# EAGLE board USB_Amp (EAGLE 9.6.2)
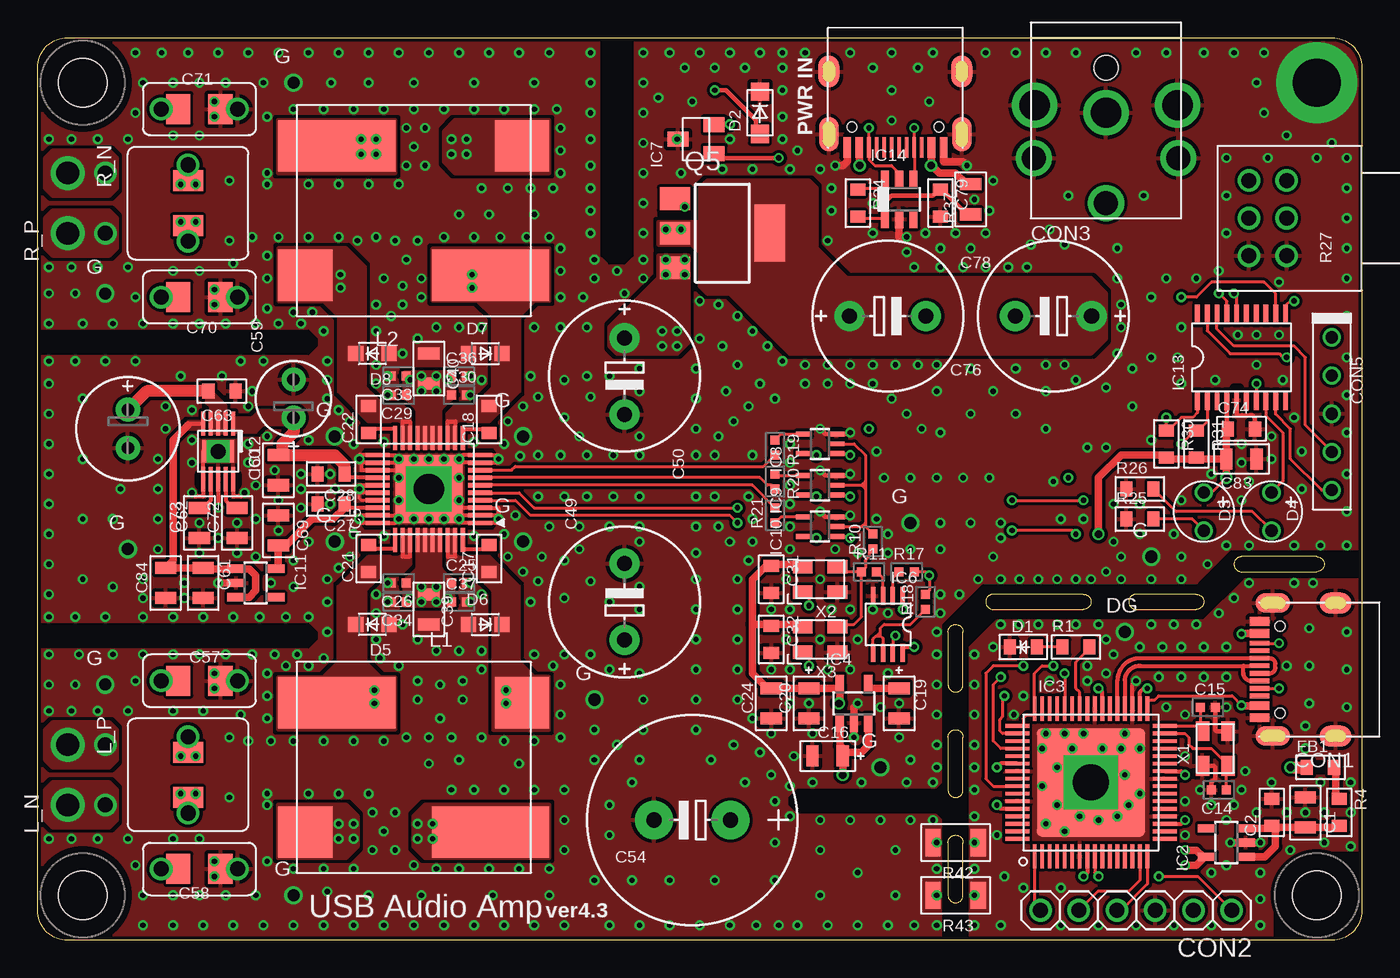
[diagram p2: board, top side]
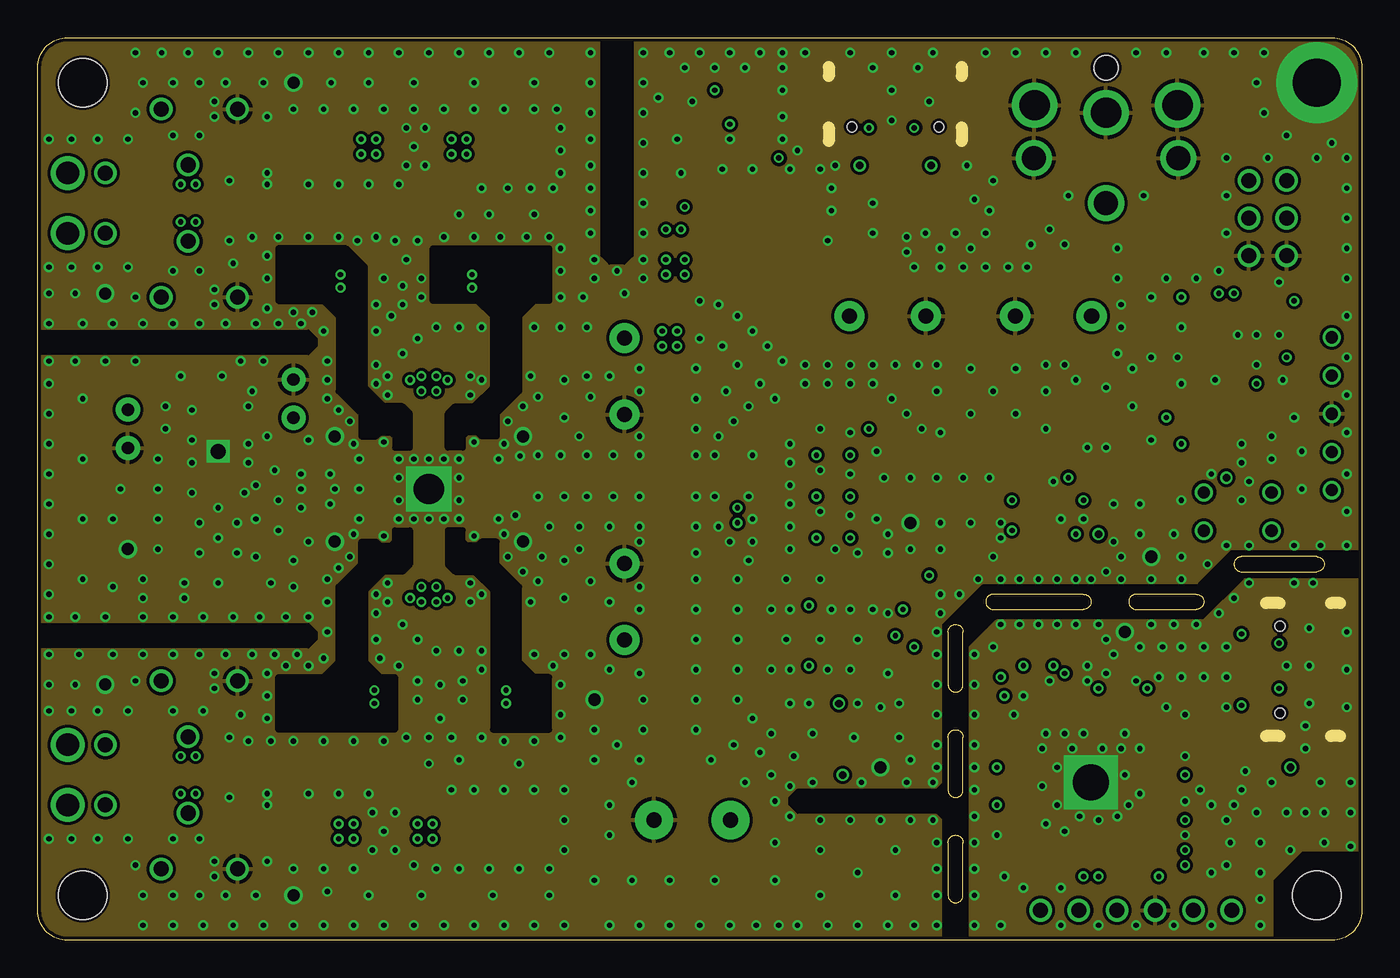
[diagram p3: board, inner layer Route2]
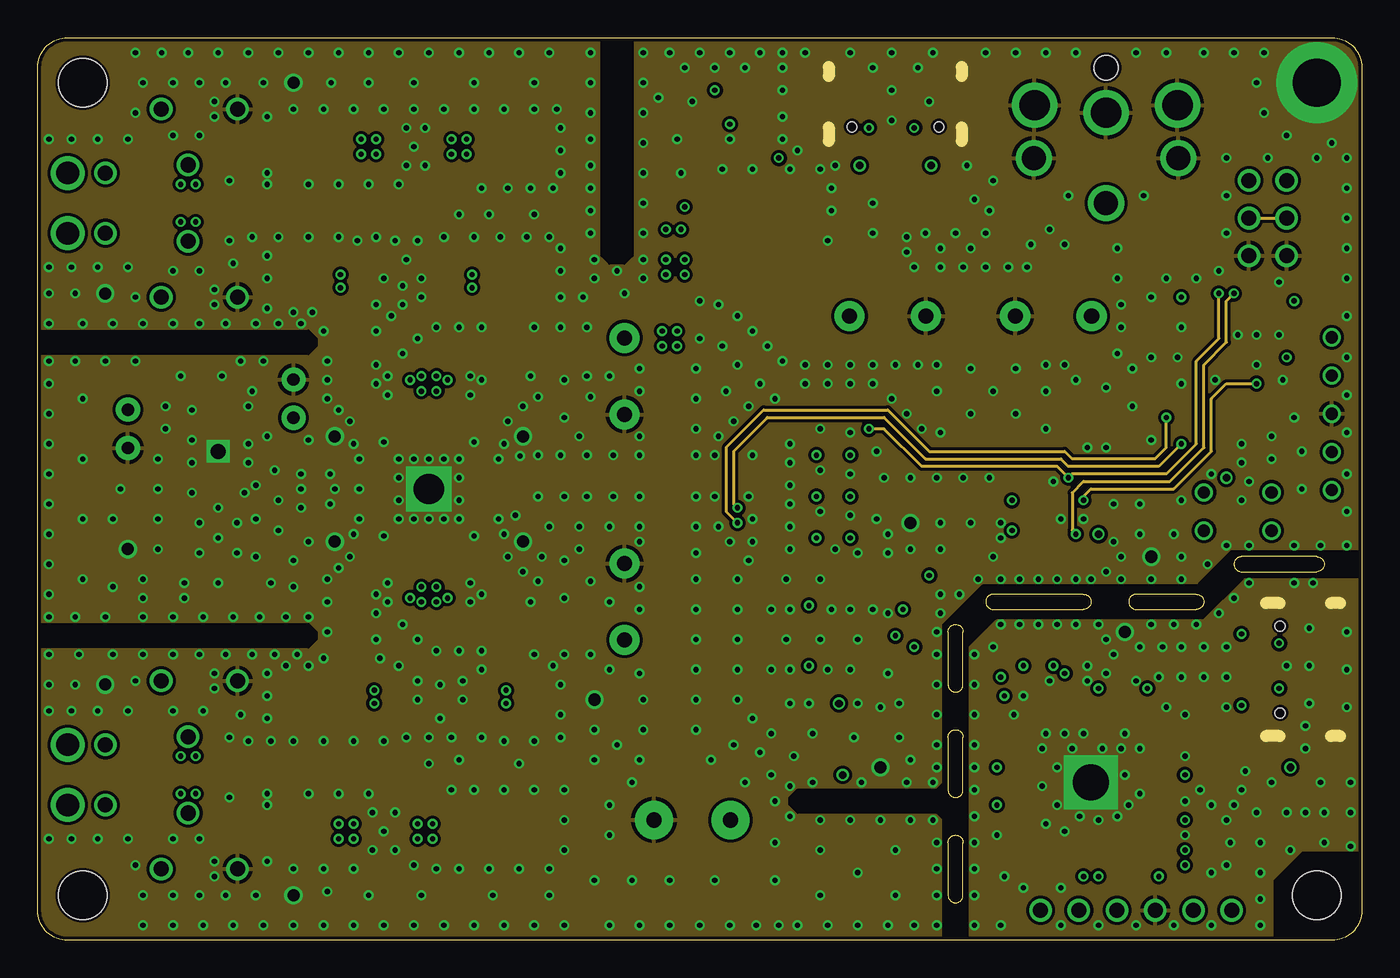
[diagram p4: board, inner layer Route15]
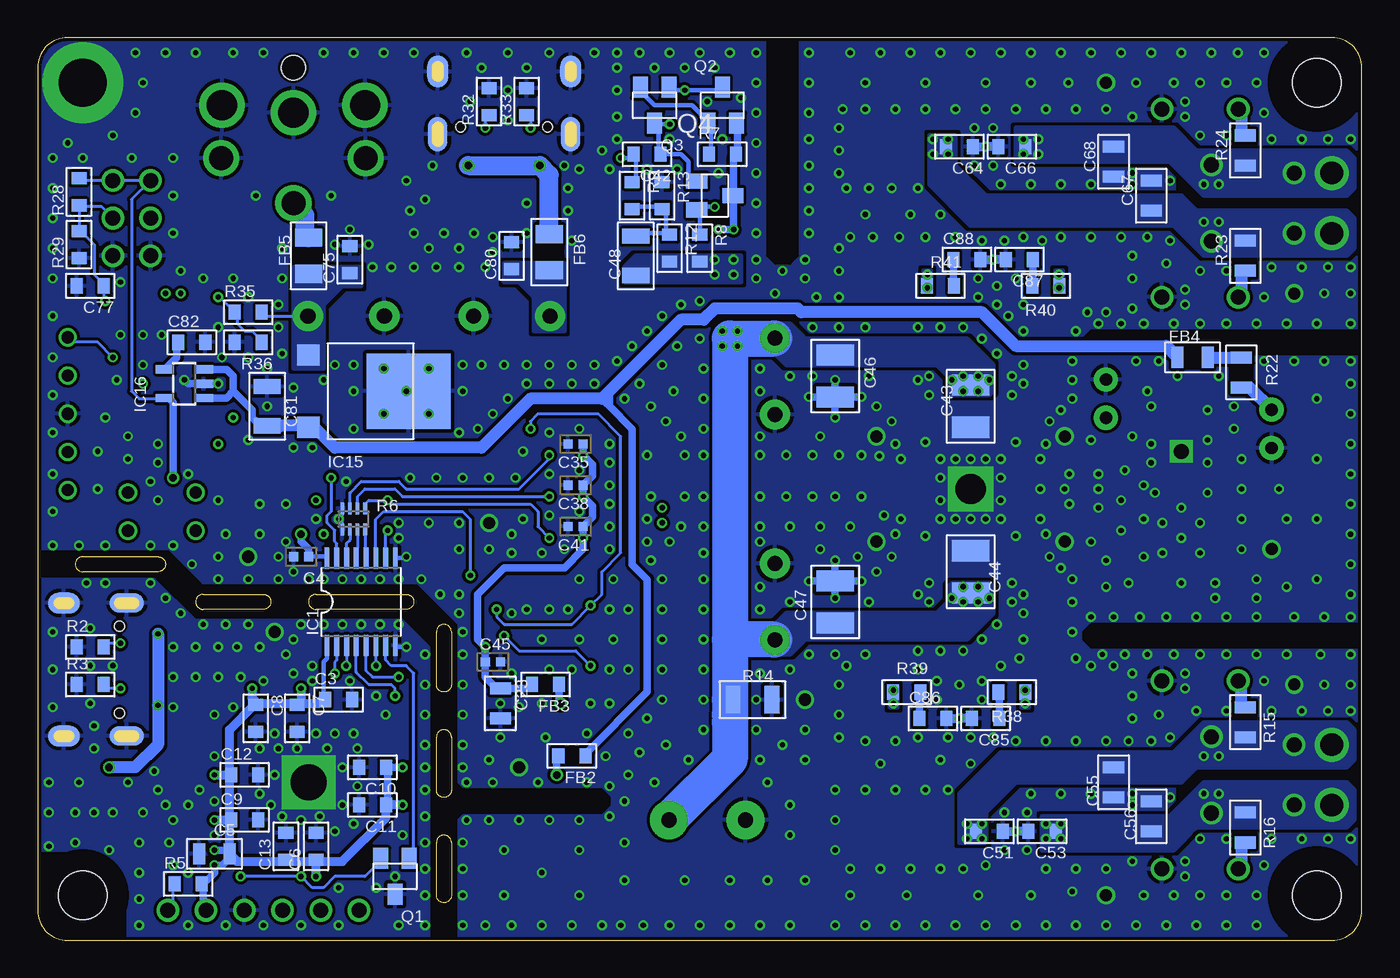
[diagram p5: board, bottom side, seen from below]

Size 88 x 60 mm. Coordinates in mm from the lower left corner, seen from the top.
Outline: 0,2 0,58 arc-90 2,60 86,60 arc-90 88,58 88,2 arc-90 86,0 2,0 arc-90 0,2
Outline: 69.5,23 arc-180 69.5,22 63.5,22 arc-180 63.5,23 69.5,23
Outline: 85,25.5 arc-180 85,24.5 80,24.5 arc-180 80,25.5 85,25.5
Outline: 77,23 arc-180 77,22 73,22 arc-180 73,23 77,23
Outline: 60.5,20.5 arc-180 61.5,20.5 61.5,17 arc-180 60.5,17 60.5,20.5
Outline: 60.5,6.5 arc-180 61.5,6.5 61.5,3 arc-180 60.5,3 60.5,6.5
Outline: 60.5,13.5 arc-180 61.5,13.5 61.5,10 arc-180 60.5,10 60.5,13.5
Copper layers (1*2*15*16): Top 0.035mm / dielectric 0.2mm / Route2 0.0175mm / dielectric 1.065mm / Route15 0.0175mm / dielectric 0.2mm / Bottom 0.035mm
Design rules "JLCPCB_4layer_2oz *": minimum track width 8mil, minimum drill 0.3mm, track to track 8mil, track to pad 8mil, pad to pad 8mil, via to via 8mil, smd to smd 0mil, copper to edge 0.2mm, drill to drill 0.4mm, minimum pad ring 8mil, minimum via ring 6mil, stop-mask expansion 2mil, vias tented up to drill 1mm, thermal gap 10mil
Net classes: 1 USB: width 0.27 mm
tRestrict: 3 lines
bRestrict: 8 lines

## Footprints (pad centres in the part's own frame; a part is rotated, then mirrored left to right if it is on the bottom)
2012 = smd 0.8 x 1.4: 1 -1,0; 2 1,0
1608C = smd 0.8 x 1: 1 -0.9,0; 2 0.9,0
1005 = smd 0.6 x 0.6: 1 -0.5,0; 2 0.5,0
2012-POL = smd 0.8 x 1.4: 1 -1,0; 2 1,0
3225 = smd 1.4 x 2.5: 1 -1.4,0; 2 1.4,0
3216 = smd 1 x 1.8: 1 -1.3,0; 2 1.3,0
E5-10 = drill 1 pad 2: + -2.54,0; - 2.54,0
C050W = drill 1: 1 -2.54,0; 2 2.54,0 | smd 1.4 x 2: 3 -1.5,0; 4 1.5,0
E5-13 = drill 1.016 pad 2.54: + -2.54,0; - 2.54,0
C050W2 = drill 1: 1 -2.54,0; 2 2.54,0 | smd 1.6 x 2: 3 -1.4,0; 4 1.4,0
E2.5-5 = drill 0.813 pad 1.6: + -1.27,0; - 1.27,0
E2.5-6.5 = drill 0.813 pad 1.6: + -1.27,0; - 1.27,0
5077CR-16-SMC2-BK-TR-2OZ = smd 0.58 x 1.34: A1,B12:GND -3.2,0.3; A4,B9:VBUS -2.4,0.3; B1,A12:GND 3.2,0.3; B4,A9:VBUS 2.4,0.3 | smd 0.28 x 1.34: A5:CC1 -1.25,0.3; A6:DP1 -0.25,0.3; A7:DN1 0.25,0.3; A8:SBU1 1.25,0.3; B5:CC2 1.75,0.3; B6:DP2 0.75,0.3; B7:DN2 -0.75,0.3; B8:SBU2 -1.75,0.3 | smd 1.3 x 2.3: SHILED1 -4.42,-0.57; SHILED2 4.42,-0.57 | smd 1.4 x 2.1: SHILED3 -4.42,-4.75; SHILED4 4.42,-4.75 | smd 1.3 x 2.3 bottom: SHILED5 -4.42,-0.57; SHILED7 4.42,-0.57 | smd 1.4 x 2.1 bottom: SHILED6 -4.42,-4.75; SHILED8 4.42,-4.75 | hole 0.65: -2.89,-1.07; 2.89,-1.07
1X06 = drill 1: 1 -6.35,0; 2 -3.81,0; 3 -1.27,0; 4 1.27,0; 5 3.81,0; 6 6.35,0
2.1MM_CON = drill 1.6: 1 0,-6; 5 -4.8,-3; 6 4.8,-3 | drill 2: 2 0,0; 3 -4.75,0.5; 4 4.75,0.5 | hole 1.6: 0,3
SWD_CON = drill 0.8: 1 -5.08,0; 2 -2.54,0; 3 0,0; 4 2.54,0; 5 5.08,0
D1608 = smd 0.8 x 1: A 0.9,0; K -0.9,0
SOD123 = smd 1.2 x 1.2: 1 -1.4,0; 2 1.4,0
LED2.5 = drill 0.813: A -1.27,0; K 1.27,0
SOD323 = smd 1 x 1: 1 -1.1,0; 2 1.1,0
HOLE_3.2 = hole 3.2: 0,0
HOLE_3.2_CON2 = drill 3.2 pad 5.4: T 0,0
1608-FB = smd 0.8 x 1: 1 -0.9,0; 2 0.9,0
2012-R = smd 0.8 x 1.4: 1 -1,0; 2 1,0
3216-FB = smd 1.2 x 1.8: 1 -1.2,0; 2 1.2,0
TSSOP16 = smd 0.32 x 1.4: 1 -2.275,-2.9; 2 -1.625,-2.9; 3 -0.975,-2.9; 4 -0.325,-2.9; 5 0.325,-2.9; 6 0.975,-2.9; 7 1.625,-2.9; 8 2.275,-2.9; 9 2.275,2.9; 10 1.625,2.9; 11 0.975,2.9; 12 0.325,2.9; 13 -0.325,2.9; 14 -0.975,2.9; 15 -1.625,2.9; 16 -2.275,2.9
SOT23-5 = smd 0.55 x 1.2: 1 -0.95,-1.3; 2 0,-1.3; 3 0.95,-1.3; 4 0.95,1.3; 5 -0.95,1.3
QFN64HT = smd 0.25 x 1.6: 1 -3.75,-4.9; 2 -3.25,-4.9; 3 -2.75,-4.9; 4 -2.25,-4.9; 5 -1.75,-4.9; 6 -1.25,-4.9; 7 -0.75,-4.9; 8 -0.25,-4.9; 9 0.25,-4.9; 10 0.75,-4.9; 11 1.25,-4.9; 12 1.75,-4.9; 13 2.25,-4.9; 14 2.75,-4.9; 15 3.25,-4.9; 16 3.75,-4.9; 33 3.75,4.9; 34 3.25,4.9; 35 2.75,4.9; 36 2.25,4.9; 37 1.75,4.9; 38 1.25,4.9; 39 0.75,4.9; 40 0.25,4.9; 41 -0.25,4.9; 42 -0.75,4.9; 43 -1.25,4.9; 44 -1.75,4.9; 45 -2.25,4.9; 46 -2.75,4.9; 47 -3.25,4.9; 48 -3.75,4.9 | smd 1.6 x 0.25: 17 4.9,-3.75; 18 4.9,-3.25; 19 4.9,-2.75; 20 4.9,-2.25; 21 4.9,-1.75; 22 4.9,-1.25; 23 4.9,-0.75; 24 4.9,-0.25; 25 4.9,0.25; 26 4.9,0.75; 27 4.9,1.25; 28 4.9,1.75; 29 4.9,2.25; 30 4.9,2.75; 31 4.9,3.25; 32 4.9,3.75; 49 -4.9,3.75; 50 -4.9,3.25; 51 -4.9,2.75; 52 -4.9,2.25; 53 -4.9,1.75; 54 -4.9,1.25; 55 -4.9,0.75; 56 -4.9,0.25; 57 -4.9,-0.25; 58 -4.9,-0.75; 59 -4.9,-1.25; 60 -4.9,-1.75; 61 -4.9,-2.25; 62 -4.9,-2.75; 63 -4.9,-3.25; 64 -4.9,-3.75 | drill 2.4 pad 3.6 square: HT 0,0 | smd 7.2 x 7.2: HT2 0,0
QFN40HT = smd 0.28 x 1.6: 1 -2.25,-3.4; 2 -1.75,-3.4; 3 -1.25,-3.4; 4 -0.75,-3.4; 5 -0.25,-3.4; 6 0.25,-3.4; 7 0.75,-3.4; 8 1.25,-3.4; 9 1.75,-3.4; 10 2.25,-3.4; 21 2.25,3.4; 22 1.75,3.4; 23 1.25,3.4; 24 0.75,3.4; 25 0.25,3.4; 26 -0.25,3.4; 27 -0.75,3.4; 28 -1.25,3.4; 29 -1.75,3.4; 30 -2.25,3.4 | smd 1.6 x 0.28: 11 3.4,-2.25; 12 3.4,-1.75; 13 3.4,-1.25; 14 3.4,-0.75; 15 3.4,-0.25; 16 3.4,0.25; 17 3.4,0.75; 18 3.4,1.25; 19 3.4,1.75; 20 3.4,2.25; 31 -3.4,2.25; 32 -3.4,1.75; 33 -3.4,1.25; 34 -3.4,0.75; 35 -3.4,0.25; 36 -3.4,-0.25; 37 -3.4,-0.75; 38 -3.4,-1.25; 39 -3.4,-1.75; 40 -3.4,-2.25 | drill 2 pad 3 square: HT 0,0 | smd 4.5 x 4.5: HT2 0,0
SSOP8-P-0.65 = smd 0.3 x 1.2: 1 -0.975,-1.9; 2 -0.325,-1.9; 3 0.325,-1.9; 4 0.975,-1.9; 5 0.975,1.9; 6 0.325,1.9; 7 -0.325,1.9; 8 -0.975,1.9
SC59 = smd 1 x 1.4: 1 -0.95,-1.2; 2 0.95,-1.2; 3 0,1.2
TSSOP5 = smd 0.32 x 1: 1 -0.65,-1.1; 2 0,-1.1; 3 0.65,-1.1; 4 0.65,1.1; 5 -0.65,1.1
PLP10 = smd 0.26 x 1.6: 1 -1,-1.85; 2 -0.5,-1.85; 3 0,-1.85; 4 0.5,-1.85; 5 1,-1.85; 6 1,1.85; 7 0.5,1.85; 8 0,1.85; 9 -0.5,1.85; 10 -1,1.85 | drill 1 pad 1.5 square: HT 0,0 | smd 2.1 x 1.5: HT2 0,0
TSSOP20 = smd 0.32 x 1.3: 1 -2.925,-2.85; 2 -2.275,-2.85; 3 -1.625,-2.85; 4 -0.975,-2.85; 5 -0.325,-2.85; 6 0.325,-2.85; 7 0.975,-2.85; 8 1.625,-2.85; 9 2.275,-2.85; 10 2.925,-2.85; 11 2.925,2.85; 12 2.275,2.85; 13 1.625,2.85; 14 0.975,2.85; 15 0.325,2.85; 16 -0.325,2.85; 17 -0.975,2.85; 18 -1.625,2.85; 19 -2.275,2.85; 20 -2.925,2.85
SOT23-6 = smd 0.55 x 1.2: 1 -0.95,-1.3; 2 0,-1.3; 3 0.95,-1.3; 4 0.95,1.3; 5 0,1.3; 6 -0.95,1.3
DPAK = smd 1.4 x 1.5: 1 -2.4,0; 3 2.4,0 | smd 5 x 5.6: 2 0,6.65
UA8014 = smd 7.8 x 3.4: 1 -5.1,4.3; 3 5.1,-4.3 | smd 3.6 x 3.4: 2 -7.2,-4.3; 4 7.2,4.3
SOT223 = smd 1.5 x 2: 1 -2.3,-3.15; 2 0,-3.15; 3 2.3,-3.15 | smd 3.8 x 2: 4 0,3.15
1608 = smd 0.8 x 1: 1 -0.9,0; 2 0.9,0
EXB28V = smd 0.26 x 0.8: 1 -0.75,-0.7; 2 -0.25,-0.7; 3 0.25,-0.7; 4 0.75,-0.7; 5 0.75,0.7; 6 0.25,0.7; 7 -0.25,0.7; 8 -0.75,0.7
RK0972 = drill 1: 1 -2.5,0; 2 0,0; 3 2.5,0; 4 -2.5,2.5; 5 0,2.5; 6 2.5,2.5
3216-2 = smd 1 x 1.8: 1 -1.5,0; 2 1.5,0
TESTPIN-BIG = drill 1.5: 1 0,0
TESTPIN = drill 0.8: 1 0,0
TESTPIN-MID = drill 1 pad 1.4: 1 0,0
KC3225-CRYSTAL = smd 1.3 x 0.9: 1 -1.15,-0.85; 2 1.15,-0.85; 3 1.15,0.85; 4 -1.15,0.85
KC3225 = smd 1.3 x 0.9: 1 -1.15,-0.85; 2 1.15,-0.85; 3 1.15,0.85; 4 -1.15,0.85

## Placement (x,y rotation side)
C1  10u  [2012]  84.25,8.5 90 top
C2  1u  [1608C]  82,8.5 90 top
C3  0.1u  [1608C]  68,16 0 bottom
C4  0.1u  [1005]  70.5,25.5 180 bottom
C5  10u  [2012]  76.25,5.75 180 bottom
C6  0.1u  [1608C]  69.5,6.25 90 bottom
C7  0.1u  [1608C]  70.75,14.75 270 bottom
C8  0.1u  [1608C]  73.5,14.75 270 bottom
C9  0.1u  [1608C]  74.25,8 0 bottom
C10  0.1u  [1608C]  65.75,11.5 180 bottom
C11  0.1u  [1608C]  65.75,9 180 bottom
C12  0.1u  [1608C]  74.25,11 0 bottom
C13  1u  [1608C]  71.5,6.25 90 bottom
C14  10p  [1005]  78.5,10 180 top
C15  10p  [1005]  77.75,15.5 0 top
C16  10u  [2012-POL]  52.5,12.25 180 top
C17  0.22u  [1608C]  30,25.38 90 top
C18  0.22u  [1608C]  30,34.62 90 top
C19  2.2u  [2012-POL]  57.25,15.75 270 top
C20  10u  [2012-POL]  51.25,15.75 270 top
C21  0.22u  [1608C]  22,25.38 90 top
C22  0.22u  [1608C]  22,34.62 90 top
C23  10u  [2012]  57.25,15.75 270 bottom
C24  2.2u  [2012]  48.75,15.75 270 top
C25  10n  [1005]  28,23.75 0 top
C26  10n  [1005]  24,23.75 180 top
C27  0.1u  [1608C]  19.5,29 180 top
C28  0.1u  [1608C]  19.5,31 180 top
C29  10n  [1005]  24,36.25 180 top
C30  10n  [1005]  28,36.25 0 top
C31  0.1u  [1608C]  48.75,24 270 top
C32  0.1u  [1608C]  48.75,20 270 top
C33  0.1u  [1005]  24,37.5 180 top
C34  0.1u  [1005]  24,22.5 180 top
C35  0.1u  [1005]  52.25,33 180 bottom
C36  0.1u  [1005]  28,37.5 0 top
C37  0.1u  [1005]  28,22.5 0 top
C38  0.1u  [1005]  52.25,30.25 180 bottom
C39  1u  [2012]  26,22 270 top
C40  1u  [2012]  26,38 90 top
C41  0.1u  [1005]  52.25,27.5 180 bottom
C42  DNP  [1608C]  47.5,52.25 180 bottom
C43  10u  [3225]  26,35.5 270 bottom
C44  10u  [3225]  26,24.5 90 bottom
C45  0.1u  [1005]  57.75,18.5 0 bottom
C46  10u  [3225]  35,37.5 270 bottom
C47  10u  [3225]  35,22.5 90 bottom
C48  4.7u  [3216]  48.25,45.5 90 bottom
C49  16V 680u  [E5-10]  39,22.5 90 top
C50  16V 680u  [E5-10]  39,37.5 270 top
C51  100p  [1608C]  24.75,7.25 180 bottom
C52  0.22u  [C050W]  10,11 270 top
C53  100p  [1608C]  21.25,7.25 180 bottom
C54  16V 2200u  [E5-13]  43.5,8 180 top
C55  1n  [2012]  16.5,10.5 90 bottom
C56  1n  [2012]  14,8.25 90 bottom
C57  10n  [C050W2]  10.75,17.25 180 top
C58  10n  [C050W2]  10.75,4.75 0 top
C59  47u  [E2.5-5]  17,36 90 top
C60  10u  [2012]  16,31.25 270 top
C61  4.7u  [2012]  11,23.75 270 top
C62  100u  [E2.5-6.5]  6,34 270 top
C63  0.1u  [1608C]  12.25,36.5 0 top
C64  100p  [1608C]  26.75,52.75 180 bottom
C65  0.22u  [C050W]  10,49 90 top
C66  100p  [1608C]  23.25,52.75 180 bottom
C67  1n  [2012]  14,49.5 270 bottom
C68  1n  [2012]  16.5,51.75 270 bottom
C69  10u  [2012]  16,27.25 90 top
C70  10n  [C050W2]  10.75,42.75 180 top
C71  10n  [C050W2]  10.75,55.25 0 top
C72  10u  [2012]  13.25,27.75 270 top
C73  10u  [2012]  10.75,27.75 270 top
C74  0.1u  [1608C]  80,34 0 top
C75  0.1u  [1608C]  67.25,45.25 90 bottom
C76  25V 1000u  [E5-10]  67.5,41.5 180 top
C77  1n  [1608C]  84.5,43.5 180 bottom
C78  25V 1000u  [E5-10]  56.5,41.5 0 top
C79  1u  [1608C]  60,49 270 top
C80  0.1u  [1608C]  56.5,45.5 90 bottom
C81  10u  [3216]  72.75,35.5 90 bottom
C82  0.1u  [1608C]  77.75,39.75 0 bottom
C83  22u  [2012]  80,32 0 top
C84  4.7u  [2012]  8.5,23.75 270 top
C85  100p  [1608C]  25,14.75 180 bottom
C86  100p  [1608C]  28.5,14.75 0 bottom
C87  100p  [1608C]  22.75,45.25 180 bottom
C88  100p  [1608C]  26.25,45.25 0 bottom
CON1  AUDIO_IN  [5077CR-16-SMC2-BK-TR-2OZ]  81.5,18 90 top
CON2  PROG  [1X06]  73,2 180 top
CON3  PWR IN  [2.1MM_CON]  71,55 0 top
CON4  USB-C-2OZ  [5077CR-16-SMC2-BK-TR-2OZ]  57,53 180 top
CON5  SWD  [SWD_CON]  86,35 270 top
D1  PLY  [D1608]  65.5,19.5 0 top
D2  1mA  [SOD123]  48,55 90 top
D3  PWR  [LED2.5]  77.5,28.5 270 top
D4  LED0  [LED2.5]  82,28.5 270 top
D5  SBD  [SOD323]  22.25,21 180 top
D6  SBD  [SOD323]  29.75,21 0 top
D7  SBD  [SOD323]  29.75,39 0 top
D8  SBD  [SOD323]  22.25,39 180 top
DR1  HOLE-3.2  [HOLE_3.2]  3,3 0 top
DR2  HOLE-3.2C  [HOLE_3.2_CON2]  85,57 0 top
DR3  HOLE-3.2  [HOLE_3.2]  85,3 0 top
DR4  HOLE-3.2  [HOLE_3.2]  3,57 0 top
FB1  FB  [1608-FB]  85.25,11.5 0 top
FB2  FB  [1608-FB]  52.5,12.25 180 bottom
FB3  FB  [1608-FB]  54.25,17 180 bottom
FB4  FB  [2012-R]  11.25,38.75 0 bottom
FB5  FB  [3216-FB]  70,45.5 270 bottom
FB6  FB  [3216-FB]  54,45.75 270 bottom
IC1  ISO7762  [TSSOP16]  66.5,22.5 0 bottom
IC2  3.3V  [SOT23-5]  79,6.5 90 top
IC3  PIC32MZEF  [QFN64HT]  70,10.5 0 top
IC4  TAR5SB33  [SOT23-5]  54.25,15.75 0 top
IC5  SSM3582  [QFN40HT]  26,30 90 top
IC6  3G04  [SSOP8-P-0.65]  56.5,21 180 top
IC7  TL431  [SC59]  43.75,53.25 90 top
IC8  74LVC1G79  [TSSOP5]  52,33 90 top
IC9  74LVC1G79  [TSSOP5]  52,30.25 90 top
IC10  74LVC1G79  [TSSOP5]  52,27.5 90 top
IC11  1.8V  [SOT23-5]  14.5,23.75 270 top
IC12  AK1110  [PLP10]  12,32.5 180 top
IC13  STM32G030F  [TSSOP20]  80,38.75 0 top
IC14  CH221  [SOT23-6]  57.25,49.25 0 top
IC15  7808  [DPAK]  70,36.5 270 bottom
IC16  TAR5SB33  [SOT23-5]  78.25,37 90 bottom
L1  7uH-UA8013  [UA8014]  25,11.5 0 top
L2  7uH-UA8013  [UA8014]  25,48.5 180 top
Q1  PNP  [SC59]  64.25,4.25 180 bottom
Q2  PNP  [SC59]  42.5,55.5 0 bottom
Q3  PNP  [SC59]  47,55.5 180 bottom
Q4  NPN  [SC59]  43,49.5 270 bottom
Q5  NPN  [SOT223]  45.5,47 270 top
R1  3.3k  [1608]  69,19.5 0 top
R2  5.1k  [1608]  84.5,19.5 0 bottom
R3  5.1k  [1608]  84.5,17 0 bottom
R4  5.1  [1608]  86.5,8.5 270 top
R5  10k  [1608]  78,3.75 0 bottom
R6  100  [EXB28V]  67,28 0 bottom
R7  100  [1608]  42.5,52.25 0 bottom
R8  1k  [1608]  44,46 270 bottom
R9  1k  [1608]  48.5,49.5 270 bottom
R10  51  [1005]  55.5,26.5 90 top
R11  51  [1005]  55.25,24.5 0 top
R12  39.2k  [1608]  46,46 270 bottom
R13  10k  [1608]  46.5,49.5 270 bottom
R14  1k  [3216]  40.5,16 180 bottom
R15  51  [2012]  7.75,14.5 90 bottom
R16  51  [2012]  7.75,7.5 90 bottom
R17  MCLK  [1005]  57.75,24.5 0 top
R18  MCLKB  [1005]  59,22.5 90 top
R19  SCK  [1005]  49,32.75 270 top
R20  DATA  [1005]  49,30.5 270 top
R21  LRCLK  [1005]  49,28.25 90 top
R22  2.2  [2012-R]  8,37.75 270 bottom
R23  51  [2012]  7.75,45.5 270 bottom
R24  51  [2012]  7.75,52.5 270 bottom
R25  3.3k  [1608]  73.25,28 0 top
R26  3.3k  [1608]  73.25,30 0 top
R27  50k  [RK0972]  83,48 90 top
R28  DNP  [1608]  85.25,49.75 90 bottom
R29  100k  [1608]  85.25,46.25 90 bottom
R30  10k  [1608]  75,33 270 top
R31  10k  [1608]  77,33 270 top
R32  5.1k  [1608]  58,55.75 90 bottom
R33  5.1k  [1608]  55.5,55.75 90 bottom
R34  100k  [1608]  54.5,49 270 top
R35  10k  [1608]  74,41.75 0 bottom
R36  1.5k  [1608]  74,39.75 180 bottom
R37  1k  [2012]  62,49.25 90 top
R38  10  [1608]  23.25,16.5 0 bottom
R39  10  [1608]  30.25,16.5 180 bottom
R40  10  [1608]  21,43.5 0 bottom
R41  10  [1608]  28,43.5 180 bottom
R42  THJ  [3216-2]  61,6.5 180 top
R43  THJ  [3216-2]  61,3 180 top
TP1  L_P  [TESTPIN-BIG]  2,13 270 top
TP2  L_N  [TESTPIN-BIG]  2,9 90 top
TP3  R_P  [TESTPIN-BIG]  2,47 90 top
TP4  R_N  [TESTPIN-BIG]  2,51 270 top
TP5  DG  [TESTPIN]  72.25,20.5 0 top
TP6  G  [TESTPIN]  4.5,43 0 top
TP7  G  [TESTPIN]  19.75,26.5 0 top
TP8  G  [TESTPIN]  19.75,33.5 0 top
TP9  G  [TESTPIN]  32.25,33.5 0 top
TP10  G  [TESTPIN]  32.25,26.5 0 top
TP11  G  [TESTPIN]  4.5,17 0 top
TP12  G  [TESTPIN]  6,26 0 top
TP13  G  [TESTPIN]  37,16 0 top
TP14  G  [TESTPIN]  58,27.75 0 top
TP15  G  [TESTPIN]  56,11.5 0 top
TP16  G  [TESTPIN]  74,25.5 0 top
TP17  G  [TESTPIN]  17,3 0 top
TP18  G  [TESTPIN]  17,57 0 top
TP19  L_P  [TESTPIN-MID]  4.5,9 0 top
TP20  L_P  [TESTPIN-MID]  4.5,13 0 top
TP21  R_N  [TESTPIN-MID]  4.5,47 0 top
TP22  R_N  [TESTPIN-MID]  4.5,51 0 top
X1  12MHz  [KC3225-CRYSTAL]  78.25,12.75 270 top
X2  22.5792MHz  [KC3225]  52,24 0 top
X3  24.576MHz  [KC3225]  52,20 0 top

## Tracks (layer width: path | path; a pad name or v marks a point on that pad's centre or on a via)
+3V3  (via drill 0.5)
  Top 0.203: D3.A 78.02,29.77 v79,30.75
  Top 0.305: IC13.4 79.03,34.08 C74.1
  Top 0.508: C74.1 79,33.9 C83.1 | C83.1 77.1,32 R31.2 76.9,32 75.1,32 R30.2 74.85,32.25 72,32.25 70.5,30.75 v70.5,27 | v79,30.75 C83.1
  Bottom 0.203: R28.2 85.1,50.5 R27.3 R27.6 81.75,49.25 81.75,36.5 81.25,36 79.6,36 IC16.5
  Bottom 0.305: IC1.16 68.88,25.5 C4.1
  Bottom 0.508: v70.5,27 70.5,26.5 70,26 C4.1 | IC16.5 79.3,36.05 79,35.75 v79,30.75
+3V3A  (via drill 0.35)
  Top 0.305: IC8.5 51.65,32.35 v51.75,32.25 | IC9.5 51.65,29.6 v51.75,29.5 | IC10.5 51.65,26.85 v51.75,26.75 | IC6.8 57.48,19.5 v58.25,19.5
  Bottom 0.508: FB3.2 55.4,16.75 56.75,16.75 C23.1 57.5,16.75 58.25,17.5 C45.1 v58.25,19.5 58.75,20 58.75,23 57,24.75 53,24.75 51.75,26 v51.75,26.75 C41.1 51.12,28.12 51.12,28.88 v51.75,29.5 C38.1 51.12,30.88 51.12,31.62 v51.75,32.25 C35.1
+3V3D  (via drill 0.35)
  Top 0.254: IC3.26 76,11.25 v76.25,11 | IC3.19 76,7.75 v76.25,8 | IC3.8 69.75,4.5 v69.5,4.25 | IC3.60 64,8.75 v63.75,9 | IC3.54 64,11.75 v63.75,11.5 | IC3.39 70.75,16.5 v70.5,16.75 | IC3.34 73.25,16.5 73.5,16.75 v73.75,16.75
  Top 0.508: v76.25,6 77,6 77.45,5.55 IC2.5 77.55,5.55 77,5 v76.25,5
  Bottom 0.203: 77,3.65 R5.2
  Bottom 0.305: IC1.1 68.78,18.73 69,18.5 69,16.1
  Bottom 0.508: v76.25,6 75.5,6 C5.1 75.25,5.5 75.75,5 v76.25,5 76.25,4.5 77,3.75 R5.2 | CON2.2 77,2.19 77,3.65 | C11.1 64.75,9.1 64.75,11.4 | 64.75,11.4 C10.1 | v63.75,11.5 64.65,11.5 64.75,11.4
  Bottom 0.61: 75.25,7.9 C9.1 75.25,8.1 75.25,10.9 | 75.25,7.9 C5.1 74.75,5.25 71.6,5.25 C13.1 71.4,5.25 69.6,5.25 | 75.25,10.9 C12.1 75.25,11.1 75.25,14 73.6,15.65 C8.1 73.4,15.75 | 73.4,15.75 70.85,15.75 C7.1 70.65,15.75 | 70.65,15.75 69.35,15.75 69,16.1 C3.1 | 69.6,5.25 C6.1 69.4,5.25 67.75,5.25 64.85,8.15 C11.1 | C11.1 64.75,9.1 | v76.25,11 75.35,11 75.25,10.9 | v76.25,8 75.35,8 75.25,7.9 | v69.5,4.25 69.5,5.15 69.6,5.25 | v63.75,9 C11.1 | v70.5,16.75 70.5,15.9 70.65,15.75 | v73.75,16.75 73.75,16.1 73.4,15.75
+8V
  Bottom 0.508: 50.5,36 50.25,35.75 50,35.5 | 50,35.5 48.5,34 48.5,25 47.5,24 47.5,16.5 51.6,12.4 FB2.1 | IC16.3 75.45,37.95 75,37.5 75,36.5 | IC16.1 75.45,36.05 75,36.5 | C81.1 73.2,34.2 73.75,34.75 73.75,35.25 75,36.5 | 50,35.5 50,36.5
  Bottom 0.813: FB4.1 13,39.5 23,39.5 25.25,41.75 37.25,41.75 37.5,42 43,42 43.75,41.25 45.25,41.25 50,36.5 50.5,36 55.25,36 58.5,32.75 68.25,32.75 69.6,34.1 IC15.3 70.15,34.25 71.75,34.25 71.8,34.2 C81.1
+12V  (via drill 0.35)
  Bottom 0.508: R14.2 42,16
  Bottom 2.3: C49.+ 39.04,20 | 39.04,40 C50.+ | 42,15 42,14.5
  Bottom 2.4: 42,20 42,40 39.04,40 | 39.04,20 42,20 | 42,20 42,15 | 42,16 42,14.5 42,12.04 C54.+
  other vias: 25.5,22.5 26.5,22.5 26.5,23.5 25.5,23.5 25.5,36.5 26.5,36.5 26.5,37.5 25.5,37.5 41.5,39.5 41.5,40.5 42.5,40.5 42.5,39.5 43,45.25 41.75,45.25 41.75,44.25 43,44.25 27.25,22.75 24.75,22.75 27.25,37.25 24.75,37.25
  pour Top (isolate 0.203, rank 2, no thermals): 26.75,27.25 25.25,27.25 25.25,24.75 24.38,23.88 24.38,22.25 27.62,22.25 27.62,23.88 26.75,24.75
  pour Bottom (no thermals): 40,21 39,21 38.25,21.75 28.25,21.75 27.5,22.5 27.5,23.5 27.25,23.75 24.75,23.75 24.5,23.5 24.5,21.75 26.25,20 37,20 38,19 40,19
  pour Top (isolate 0.203, rank 2, no thermals): 25.25,32.75 26.75,32.75 26.75,35.25 27.62,36.12 27.62,37.75 24.38,37.75 24.38,36.12 25.25,35.25
  pour Bottom (no thermals): 40,39 39,39 38.25,38.25 28.25,38.25 27.5,37.5 27.5,36.5 27.25,36.25 24.75,36.25 24.5,36.5 24.5,38.25 26.25,40 37,40 38,41 40,41
  pour Bottom (no thermals): 49,43.75 49,44.75 48.25,45.5 41.25,45.5 41.25,43.75
  pour Top (no thermals): 43.25,45.5 43.25,39.75 42.5,39 38.5,39 38,39.5 38,40.75 41.25,44 41.25,45.5
AMP_+5V
  Top 0.254: 10,34.25 10.1,34.35 IC12.5
  Top 0.508: IC11.3 14.05,22.8 14.5,23.25 14.5,24.25 14.05,24.7 IC11.1 11.05,24.7 C61.1 C84.1 9,25.25 9,33.25 10,34.25
  pour Top (isolate 0.203, no thermals): 11,34.5 10,34.5 9.75,34.25 9.75,34 11,34
AMP_AVDD
  Top 0.254: 20.45,30.95 C28.1
  Top 0.28: IC5.24 20.65,30.75 20.45,30.95
  Top 0.508: C28.1 20.4,31.6
  Top 0.813: C59.+ 17,33.75 16.25,33 16.25,32.25 C60.1 19.75,32.25 20.4,31.6
  pour Top (isolate 0.203, no thermals): 13,33.75 13,34.75 14.25,34.75 14.75,35.25 17.25,35.25 17.25,34.25 15,34.25 14.5,33.75
AMP_DVDD
  Top 0.28: IC5.28 20.65,28.75 C27.1
  Top 0.508: C27.1 20.4,28.75 19.65,28 18.25,28 16.5,26.25 C69.1 16,24.7 IC11.5
AMP_OUTN_L  (via drill 0.35)
  Top 0.254: IC5.32 24.25,25.5 24.75,25.5 IC5.33
  other vias: 22.38,16.62 22.38,15.75
  pour Top (isolate 0.254, no thermals): 24.25,25.75 24.25,27.25 24.75,27.25 24.75,25 24.25,24.5 23,24.5 21.75,23.25 21.75,18.5 22.75,17.5 23.75,17.5 23.75,14 16,14 16,17.5 19,17.5 20,18.5 20,23.5 22,25.5 24,25.5
  pour Bottom (isolate 0.203, no thermals): 22.12,16.88 22.62,16.88 22.62,15.5 22.12,15.5
AMP_OUTN_R  (via drill 0.35)
  Top 0.254: IC5.19 24.25,34.5 24.75,34.5 IC5.18
  other vias: 20.12,43.38 20.12,44.25
  pour Top (isolate 0.254, no thermals): 24.25,34.25 24.25,32.75 24.75,32.75 24.75,35 24.25,35.5 23,35.5 21.75,36.75 21.75,44.75 20.5,46 16,46 16,42.5 19,42.5 20,41.5 20,36.5 22,34.5 24,34.5
  pour Bottom (isolate 0.203, no thermals): 20.38,43.12 19.88,43.12 19.88,44.5 20.38,44.5
AMP_OUTP_L  (via drill 0.35)
  Top 0.254: IC5.38 27.25,25.5 27.75,25.5 IC5.39
  other vias: 31.12,16.62 31.12,15.75
  pour Top (isolate 0.254, no thermals): 27.75,25.75 27.75,27.25 27.25,27.25 27.25,25 27.75,24.5 29,24.5 30.25,23.25 30.25,14 34,14 34,17.5 33,17.5 32,18.5 32,23.5 30,25.5 28,25.5
  pour Bottom (isolate 0.203, no thermals): 30.88,16.88 31.38,16.88 31.38,15.5 30.88,15.5
AMP_OUTP_R  (via drill 0.35)
  Top 0.254: IC5.13 27.25,34.5 27.75,34.5 IC5.12
  other vias: 28.88,43.38 28.88,44.25
  pour Top (isolate 0.254, no thermals): 27.75,34.25 27.75,32.75 27.25,32.75 27.25,35 27.75,35.5 29,35.5 30.25,36.75 30.25,41.5 29.25,42.5 26.25,42.5 26.25,46 34,46 34,42.5 33,42.5 32,41.5 32,36.5 30,34.5 28,34.5
  pour Bottom (isolate 0.203, no thermals): 29.12,43.12 28.62,43.12 28.62,44.5 29.12,44.5
DGND  (via drill 0.35)
  Top 0.254: IC3.35 72.75,17 v73,17.25
  Top 0.305: C14.2 78,10.5 78.25,10.75 78.25,11.5 78.15,11.6 X1.2 | C15.2 78.25,14.75 78.25,14 78.35,13.9 X1.4
  Top 0.508: v81.25,6.5 IC2.2 v79.25,6.5
  Bottom 0.305: v63.5,19.5 64.12,19.5 IC1.8
  other vias: 67.25,17.25 69.75,17.25 69.75,18.25 65.5,16.25 64.88,15 83.5,23.75 84.75,23.75 87,20.5 87,18 87,15.5 84.5,15.75 84.5,18.25 84.5,20.75 83,18.25 84.25,14.25 84.25,12.75 80.5,23.75 79.5,22.75 78.5,21.75 77,21 75.5,21 74,21 71,20 70.5,21 69,21 67.75,21 66.5,21 65.25,21 64,21 62.25,19 62.25,17 62.25,15 62.25,13 62.25,11.5 62.25,8.25 62.25,6.5 62.25,4.75 62.25,3 62.25,1 64,1 65.5,3.5 64.25,4.25 63.75,7 66.75,12.75 67,13.75 68.25,13.75 69.5,13.75 70.75,12.75 68.75,12.75 72.25,13.75 72,12.75 73.25,12.75 72.25,11 73.25,9.75 72.5,9 71.75,8.25 70.5,8 69.25,8.25 68.25,7.25 67,7.75 68,3.5 68,1 70.5,1 73,1 75.5,1 78,1 81.25,1 81.25,2.75 81.25,4.5 83.25,6 85.5,6.5 87.25,6.25 87.25,8.5 87.25,10.5 79,17.5 77.5,17.5 76,17.5 74.5,17.5 79,19.5 77.5,19.5 76,19.5 74.75,19.5 73.25,19.5 71,17.75 71.5,19 75,15.5 76.25,15 79,15.5 76.25,12.25 77.25,10 78,9 76.25,9.25 79.5,9 80.25,11.25 80,10 82,10.5 81,8.5 83,8.5 84.25,8.5 85.5,8.5 85.25,10.5 78,4.5 79,5 79,8 76.25,7 67.75,11.5 67.75,9 66.75,10.25 62.25,10
  pour Top: 62,0 62,19.5 63.75,21.25 77.5,21.25 80.25,24 88,24 88,6 84,6 82,4 82,0
  pour Bottom: 62,0 62,19.5 63.75,21.25 77.5,21.25 80.25,24 88,24 88,6 84,6 82,4 82,0
  pour Route15: 62,0 62,19.5 63.75,21.25 77.5,21.25 80.25,24 88,24 88,6 84,6 82,4 82,0
  pour Route2: 62,0 62,19.5 63.75,21.25 77.5,21.25 80.25,24 88,24 88,6 84,6 82,4 82,0
  pour Top: 62,0 62,19.5 63.75,21.25 77.5,21.25 80.25,24 88,24 88,6 84,6 82,4 82,0
  pour Top (isolate 0.203, no thermals): 63.5,0 62,0 62,8 63.5,8
EN_48K  (via drill 0.35)
  Top 0.203: X3.1 51.25,18.75 v51.25,18.25 | IC6.7 56.83,20.07 v57,20.25
  Bottom 0.203: v51.25,18.25 52.25,19.25 56,19.25 v57,20.25
EN_441K  (via drill 0.35)
  Top 0.203: X2.1 51.25,22.75 v51.25,22.25 | v78.5,43 79.03,42.48 IC13.17 | IC6.1 57.48,22.02 v57.5,22
  Route15 0.203: v55.25,34 56.25,34 58.75,31.5 67.75,31.5 v68.5,30.75 68.75,31 75,31 77,33 77,38.5 78.5,40 v78.5,43
  Bottom 0.203: v55.25,34 55.25,34.5 54.75,35 50.75,35 49.25,33.5 49.25,25.75 50.5,24.5 50.5,23 v51.25,22.25 52.5,21 57,21 57.5,21.5 v57.5,22 | v68.5,30.75 68.5,28.5 68.75,28.25 68.75,27.75 68.25,27.25 68.25,26.5 68.12,26.38 IC1.15
GND  (via drill 0.35)
  Top 0.203: IC5.2 28.25,28.25 28.12,28.12 v28,28 | IC5.27 21.5,29.25 21.38,29.38 21.38,29.75 | 21.38,29.75 v21.38,30 | IC5.26 21.75,29.75 21.62,29.75 | 21.62,29.75 21.5,29.75 21.38,29.75 | 21.62,30.12 21.62,29.75
  Top 0.254: IC12.HT2 11,32.5 IC12.6 11,29.5 10.5,29.5 v10.25,29.75 | IC12.10 13,29.5 13.5,29.5 v13.75,29.75 | IC12.8 v12,28.75 | 21.62,31.75 IC5.22 23.75,31.75 v24,32 | 21.62,31.75 21.38,31.75 v21.38,32 21.38,32.25 IC5.21 23.75,32.25 v24,32 | 21.62,31.75 21.5,31.75 21.5,31.25 IC5.23 24,31.25 v24,32 | 30.62,28.25 30.38,28.25 IC5.2 28.25,28.25 v28,28 28.25,27.75 IC5.1 30.62,27.75 v30.62,28 30.62,28.25 | v28,29.25 28,28.75 IC5.3 30.62,28.75 30.62,28.25 | IC5.30 21.38,27.75 v21.38,28 21.38,28.25 IC5.29 23.75,28.25 v24,28 23.75,27.75 IC5.30 | IC5.9 30.62,31.75 v30.62,32 30.62,32.25 IC5.10 28.25,32.25 v28,32 28.25,31.75 IC5.9
  Top 0.28: IC5.25 21.75,30.25 | 21.75,30.25 21.38,30.25 v21.38,30 | 21.75,30.25 21.62,30.12
  Top 0.305: IC13.5 79.67,34.95 79.75,34.88 80.75,34.88 80.9,34.73 C74.2 | v54,31 53.9,30.9 IC9.3 52.35,30.9 v52,31.25 | v54,28.25 53.9,28.15 IC10.3 52.35,28.15 v52,28.5 | v54,33.75 53.9,33.65 IC8.3 52.35,33.65 v52,34 | IC6.4 55.52,22.02 v55.5,22
  Top 0.508: IC11.2 v12,23.75 | v54.25,13.5 IC4.2 54.25,15.5 v54.5,15.75 | IC14.2 57.25,46.75 v57.75,46.75 | CON4.B1,A12:GND 53.8,51.8 53.5,51.5 v53,51.5 | CON4.A1,B12:GND 60.2,51.8 60.25,51.75 61.5,51.75 v61.75,51.5
  Top 1.016: C58.4 C58.2 | C57.3 C57.1 | C71.4 C71.2 | C70.1 C70.3
  Bottom 0.203: R6.1 67.75,27.75 v68,28 67.75,28.25 R6.8
  Bottom 0.305: IC1.9 63.6,25.4 v63.5,25.5
  Bottom 0.508: v76,37 IC16.2 78,37 v78.25,37.25 | C46.2 v35,37.25 | C46.2 33.27,36.1 v33.25,36.12 | C46.2 v35,34.75 | C46.2 36.73,36.1 v36.75,36.12 | C47.2 v35,22.75 | C47.2 v35,25.25 | C47.2 33.25,23.9 v33.25,23.88 | C47.2 36.73,23.9 v36.75,23.88
  Bottom 0.61: C66.2 v25,52.75 C64.1 | C51.1 v23,7.25 C53.2 | C85.2 v26.75,14.75 C86.2 | C88.2 v24.5,45.25 C87.2
  other vias: 22.5,37 23.25,36.25 28.75,36.25 23.25,23.75 28.75,23.75 23,26.88 29,26.88 29,33.12 23,33.12 38.25,32.25 40,32.25 33,19 33.25,32.25 22.5,20 26.5,19.25 29.5,19.25 20,35.25 32.25,35.5 19.25,38.5 31.25,25.5 19.25,24 19.25,20.5 24.25,39 22.5,21.75 17.5,30 14.5,30.25 14.5,28 37,14 34.75,32.25 33.5,25.5 28,19.25 14.5,25.5 17,23.5 40,17.75 36.5,40.75 40,1 40,12 59.75,1 35,6 16,29.25 17.5,31 33.25,29.5 43.75,29.5 29.5,37.25 25,32 26,32 26,28 25,28 28,30.75 24,30.75 24,29.25 38.5,44.5 34.75,42.75 15.25,33.5 14,33 14,31.75 10.25,31.75 10.25,33.25 8.5,35.5 14.25,36.5 19.44,29 19.44,31 16,27.25 15.75,31.25 14.75,21.5 9.75,22.75 15.5,23.75 13,21.5 11,21.5 17.25,19 16.5,21.5 10.75,27.75 13.25,27.75 12,26.75 10.75,25.75 13.25,25.75 51,59 50.5,52.5 55.5,58 56.75,54.5 59.25,55.75 58.5,58 56.75,56.5 55.5,47 60,46 55.5,49 52.5,46.5 52.75,50 57.75,45.75 52.75,48.5 52,51.25 64.5,44.75 36.5,32.25 47.75,1 44,1 59.75,6.5 17,41.75 15,38.5 32.06,32.19 46.5,16 46.25,13 48,12.5 19.25,36 22.5,23 28.75,22.5 28.75,37.5 23.25,37.5 45.5,51.25 50,51.25 36.5,29.5 38.25,29.5 40,29.5 35,29.5 47.25,29.5 67.5,30.5 63.25,30.75 61.5,30.75 58,30.75 56.25,30.75 55.75,32.5 33,40.75 34.75,40.75 50,33 50,31.75 50,30.25 50,29 50,27.5 50,26 52,24 52.75,22 54,22 52,20 52.5,18 54,18 49.75,20 49.75,24 48.75,22 48.75,18 50,22 50,18 54.5,20 56.5,21.75 50,15.75 51.25,15.75 51.5,13.75 48.75,13.75 47.5,14.75 57.25,15.75 57.25,13.5 56,15.5 56.5,17.75 56.5,25.75 53,26 54.5,25.75 55.75,28 80,33 82,33.5 82,32 80,31.75 80,29.25 80.5,30.5 81,38.25 82.75,37.25 83.5,34.75 87,31 87,33.75 87,36.25 87,38.75 87,41.5 87,28.5 64,24 65.25,24 66.5,24 67.75,24 69,24 70,24 72,24 72,25.5 71.5,26.5 64,26.75 69.5,28 71.5,29 73.25,29 64,27.75 71,32.75 69.75,32.75 74,33.25 72.75,35.5 71,36.75 72.75,38 75.75,38.75 76,40.75 74,38.75 72,40.75 72,42.25 74,42.75 82.5,43.75 87,44 87,46 87,48 87,50 87,52 85,52 81.75,52 79,52 79,49.5 79,47 75,44 77,44 78.5,44.5 79.75,40.25 81,40.25 82.5,40.25 84,32.5 84,30 74,24 76,24 77.75,25 80.5,26.25 79,26.25 87,26.25 83.5,26.25 85.25,26.25 73.25,27 75.5,27 76,29.25 78,31 62.25,49.25 63.25,48.5 59,47 61,47 63,47 40.25,44 40.25,59 40.25,57 40.25,55 40.25,53 40.25,51 40.25,49 40.25,47 40.25,45.25 17,25.25 18,26.5 19.75,30 17.5,28.75 18,33.25 39,43 37,45.25 20,24.75 29.5,23 23.25,22.5 27,28 27,32 21,27 31,27 21,33 31,33 29.5,40.75 28,40.75 26.5,40.75 25.25,40 13.5,38.5 9.5,37.5 12.25,37.5 10.25,35.25 6.5,38.5 0.75,38.5 0.75,21.5 9,21.5 7,21.5 4.5,21.5 2.5,21.5 18,21.5 19,40.5 31.75,28.25 45.25,42.25 46.5,41.5 47.5,40.5 48.5,39.5 49.5,38.5 24.25,21 25.25,20 22.5,38.25 22.5,40.5 19.25,37.25 4.5,38.5 2.5,38.5 0.75,37 0.75,35 0.75,33 0.75,31 0.75,29 0.75,27 0.75,25 0.75,23 14,35.5 8.5,34 8,32 8,30 8,28 8,26 9.75,23.75 40,27.5 38,27.5 36,27.5 34,27.5 32.75,22.5 32.75,37.5 32.25,24.5 19.25,22.5 19,18.75 15.25,9.75 12.75,9.5 17,13.25 19,13.25 21,13.25 23,13.25 18,9.75 20,9.75 22,9.75 12.75,50.5 15.25,50.25 18,50.25 20,50.25 22,50.25 16,46.75 18,46.75 20,46.75 21.25,46.5 15.25,51 15.25,9 22.25,6 23.75,6 23.75,8.5 22.25,8.5 24.5,54 25.75,54 25.75,51.5 24.5,51.5 18.25,41.75 23,44 15.25,45.5 15.25,44 15.25,42 25.5,42.75 25.5,44 25.25,46.5 27,46.75 29,46.75 30.75,46.75 32.5,46.75 34,46.75 34.75,46 34.75,44.5 22.75,18.75 24,18.25 25.25,16 24.5,13.5 15.5,13.25 15.25,14.75 15.25,16.25 15.25,17.75 18,18.25 16.5,18.25 29.5,18 28.25,16 29.5,13.5 31,13.25 33,13.25 34.75,13.5 34.75,15 34.75,17 34.25,18.25 12.75,13.5 9,15.25 11,15.25 9,6.75 10.75,6.75 6,6.75 4,6.75 2.25,6.75 0.75,6.75 6,15.25 4,15.25 2.25,15.25 0.75,15.25 11.75,16.75 11.75,17.75 13.5,15 10.75,19 9,19 12.5,19 14.25,19 7,19 5,19 0.75,19 2.75,19 0.75,17 6.5,17.25 11.75,5.25 11.75,4.25 6.5,5 7,3 7,1 9,3 10.75,3 12.5,3 14.5,3 15.25,5.25 17,4.75 19,4.75 21,4.75 26,11.75 27.5,10 29,10 31,10 33,10 35,10 35,8 34,4.75 32,4.75 30,4.75 28,4.75 26.5,4.75 25,5 11.75,42.25 11.75,43.25 11.75,54.75 11.75,55.75 9,53.5 10.75,53.5 9,44.5 10.75,44.5 12.75,46.5 0.75,53.25 2.25,53.25 4,53.25 6,53.25 6.5,55 7,57 6.5,59 9,57 10.75,57 12.5,57 15,57 15.25,54.75 17,55.25 19,55.25 21,55.25 23,55.25 25,55.25 27,55.25 29,55.25 31,55.25 33,55.25 34.5,55.25 34.75,54 34.75,52.5 34.75,51 34.25,50 29.5,50 31.25,50 32.75,50 0.75,44.75 0.75,43 0.75,41 2.25,44.75 4,44.75 6,44.75 6.5,42.75 7,41 3,41 5,41 9,41 10.75,41 12.5,41 16,41 17.5,41 14.5,41 15.75,19 36.75,47 36.75,48.5 36.75,51.5 36.75,53.25 36.75,55 36.75,57 36.75,59 36.75,50 9,1 11,1 13,1 15,1 17,1 19,1 21,1 23,1 25,1 27,1 29,1 31,1 33,1 35,1 38,1 42,1 46,1 49.25,1 59.75,3 59.75,11.5 59.75,13 59.75,15 59.75,17 59.75,19 59.75,20.5 60,21.75 62.5,24 61.25,23 34,59 32,59 30,59 28,59 26,59 24,59 22,59 20,59 18,59 16,59 14,59 12,59 10,59 8.25,59 42,59 44,59 46,59 48,59 49.5,59 54,59 56.75,59 59.5,59 63,59 67,59 69,59 73,59 75,59 65,59 77.5,59 81.5,59 79.5,59 81,57 81.5,55 83,53.5 86,53 24,50.25 28,48.25 23.75,46.5 22.5,46.75 23.5,41.5 36.25,42.75 37,44 25.25,17.25 28,12 32,11.75 37,12 30,48.25 33,48.25 2.5,17 2.5,43 3,36 3,32 3,28 3,24 5.5,30 5,28 40,22 40,38 38,22.5 38,37.5 38,18 36.75,19 35,19 36,26 36,33.5 43.75,27.5 43.75,32.25 47.5,32.25 40.25,16 40.25,14 44.75,12 43.75,14 43.75,16 43.75,18 43.75,20 43.75,22 43.75,24 43.75,25.75 44,40 43.75,38 43.75,36 43.75,34 40,23.5 40,36.5 40,33.5 40,26.5 47.25,35.5 48,37 49,36 51,38.25 51,37 52.5,37 52.5,38.25 54,38.25 54,37 55.5,37 55.5,38.25 57,38.25 58.5,38.25 59.75,38.25 56.75,36 57.75,35 58.75,34 59.75,36.5 67,36.5 62,38 62,35 65,35 65,38 63.5,36.5 67,34 60,44.75 63,44.75 65.75,44.75 67,38.25 68.25,38.25 69,37.25 71.75,39 71.75,44 71.75,46 67.25,47.25 68.25,46.25 66,46.25 68.5,49.5 73.5,49.5 46,53.25 42.5,53.25 43.5,55.75 42.75,51 49.5,53.25 49.5,56.5 49.5,58 47,58 45,58 43,58 41.25,56 62,27.75 60,27.75 56.5,27 58,26 60,26 60,23 47.5,28 47.5,26.5 46.5,24 46.5,22 46.5,20 46.5,18 50.25,12.25 48.75,11 51.5,10.5 58,12 54.75,10.5 57.75,10.5 19.25,3.25 22,3 25.5,3 30.25,3 34,3 39.5,4 42,4 45,4 49,4 59.75,4.75 50,10.25 19.5,57 22,57 25,57 33,57 29,57 38,7 38,9 39.5,10.5 38.5,13 47,10.5 49,9.25 49,6.5 50,8.25 37,4 58.25,44.75 61.5,44.75 62,46 63.5,50.5 60,33.75 46,26.5 7,22.75 5,23.5 7,24 20.75,34.5 31.25,34.5 20.75,25.5 76,25.5 71,24.5 28.25,17.25 26,13.5 27.5,13.5 26.75,17 22.5,42.25 24.25,42.25 24.25,43.5 59.75,30.75 46.5,38.25 45.5,39.5 13,45 14.25,46.75 14,13.25 47.5,51.25 49.5,54.75 45.25,33.5 46.25,34.5 45.75,36.5 45,29.5 59.5,10.5 52,8 54,8 56,8 58,8 59.5,8 50.5,1 52.5,1 54.5,1 56.5,1 58.25,1 52,3 52,6 54.5,4.5 57,6 57,3 36.5,37.5 45.25,27.5 45,32.25 47.25,25.25 44,42.5
  pour Top (isolate 0.203, rank 4): 0,0 0,60 88,60 88,26 79.25,26 77,23.75 62.75,23.75 60,21 60,0
  pour Bottom (isolate 0.203, rank 4): 0,0 60,0 60,21 62.75,23.75 77,23.75 79.25,26 88,26 88,60 0,60
  pour Route2 (isolate 0.203, rank 4): 0,60 88,60 88,26 79.25,26 77,23.75 62.75,23.75 60,21 60,0 0,0
  pour Route15 (isolate 0.203, rank 4): 0,60 88,60 88,26 79.25,26 77,23.75 62.75,23.75 60,21 60,0 0,0
  cutout Top (isolate 0.203, no thermals): 21.75,32.62 21.75,27.38 23.56,27.38 23.56,32.62
  cutout Top (isolate 0.203, no thermals): 30.25,27.38 30.25,32.62 28.44,32.62 28.44,27.38
  cutout Top (isolate 0.203, no thermals): 39.5,60 39.5,45.5 39,45 38,45 37.5,45.5 37.5,60
  cutout Bottom (isolate 0.203, no thermals): 39.5,60 39.5,45.5 39,45 38,45 37.5,45.5 37.5,60
  cutout Route15 (isolate 0.203, no thermals): 39.5,60 39.5,45.5 39,45 38,45 37.5,45.5 37.5,60
  cutout Route2 (isolate 0.203, no thermals): 39.5,60 39.5,45.5 39,45 38,45 37.5,45.5 37.5,60
  cutout Route2 (no thermals): 23.75,27.25 24.75,27.25 24.75,25 24.25,24.5 23,24.5 21.75,23.25 21.75,18.5 22.75,17.5 23.75,17.5 23.75,14 16,14 16,17.5 19,17.5 20,18.5 20,23.5 21.5,25 21.5,26.5 22.5,26.5 22.75,26.25 23.5,26.25 23.75,26.5
  cutout Route2 (no thermals): 28.25,27.25 27.25,27.25 27.25,25 27.75,24.5 29,24.5 30.25,23.25 30.25,14 34,14 34,17.5 33,17.5 32,18.5 32,23.5 30.5,25 30.5,26.5 29.5,26.5 29.25,26.25 28.5,26.25 28.25,26.5
  cutout Route2 (isolate 0.203, no thermals): 0,21 18,21 18.5,20.5 18.5,20 18,19.5 0,19.5
  cutout Route2 (no thermals): 28.25,32.75 27.25,32.75 27.25,35 27.75,35.5 29,35.5 30.25,36.75 30.25,41.5 29.25,42.5 26.25,42.5 26.25,46 34,46 34,42.5 33,42.5 32,41.5 32,36.5 30.5,35 30.5,33.5 29.5,33.5 29.25,33.75 28.5,33.75 28.25,33.5
  cutout Route2 (no thermals): 23.75,32.75 24.75,32.75 24.75,35 24.25,35.5 23,35.5 21.75,36.75 21.75,44.75 20.5,46 16,46 16,42.5 19,42.5 20,41.5 20,36.5 21.5,35 21.5,33.5 22.5,33.5 22.75,33.75 23.5,33.75 23.75,33.5
  cutout Bottom (no thermals): 12.25,50.75 12.25,50 11.5,50
  pour Top (rank 4, no thermals): 22.25,20 29.75,20 29.75,24 30,24.25 22.25,24.25
  pour Top (rank 4, no thermals): 22.25,35.75 29.75,35.75 29.75,40 22.25,40
  pour Bottom (no thermals): 28.25,24.75 24,24.75 24,35.25 28,35.25 28,25
  pour Bottom (rank 4, no thermals): 18.5,8 18.5,11 12.25,11 12.25,8
  pour Bottom (rank 4, no thermals): 18.25,49 18.25,52 12,52 12,49
  cutout Bottom (no thermals): 11.5,10 12.25,10 12.25,9.25
  cutout Top (no thermals): 41.75,48 41.75,48.5 41.25,48.5 41.25,48
  pour Top (isolate 0.203, no thermals): 60,0 58.5,0 58.5,8 60,8
GND1
  cutout Top (isolate 0.203, no thermals): 0,21 18,21 18.5,20.5 18.5,20 18,19.5 0,19.5
  cutout Route15 (isolate 0.203, no thermals): 0,21 18,21 18.5,20.5 18.5,20 18,19.5 0,19.5
  cutout Bottom (isolate 0.203, no thermals): 0,21 18,21 18.5,20.5 18.5,20 18,19.5 0,19.5
GND2
  cutout Route2 (isolate 0.203, no thermals): 0,40.5 18,40.5 18.5,40 18.5,39.5 18,39 0,39
GND3
  cutout Top (isolate 0.203, no thermals): 0,40.5 18,40.5 18.5,40 18.5,39.5 18,39 0,39
  cutout Bottom (isolate 0.203, no thermals): 0,40.5 18,40.5 18.5,40 18.5,39.5 18,39 0,39
  cutout Route15 (isolate 0.203, no thermals): 0,40.5 18,40.5 18.5,40 18.5,39.5 18,39 0,39
GND4
  cutout Route2 (isolate 0.203, no thermals): 60.25,8 59.75,8.5 50.5,8.5 50,9 50,9.5 50.5,10 59.75,10 60.25,10.5
GND5
  cutout Top (isolate 0.203, no thermals): 60.25,8 59.75,8.5 50.5,8.5 50,9 50,9.5 50.5,10 59.75,10 60.25,10.5
  cutout Route15 (isolate 0.203, no thermals): 60.25,8 59.75,8.5 50.5,8.5 50,9 50,9.5 50.5,10 59.75,10 60.25,10.5
  cutout Bottom (isolate 0.203, no thermals): 60.25,8 59.75,8.5 50.5,8.5 50,9 50,9.5 50.5,10 59.75,10 60.25,10.5
I2C_SCL  (via drill 0.35)
  Top 0.203: IC5.4 31.75,29.25 32.75,28.25 46,28.25 v46.5,27.75 | IC13.1 77.08,35.08 76.75,34.75 76,34.75 75.15,33.9 R30.1 v75,34.75
  Route15 0.203: v46.5,27.75 45.75,28.5 45.75,32.75 48.25,35.25 56.5,35.25 59.25,32.5 68.25,32.5 68.75,32 74.25,32 75,32.75 v75,34.75
I2C_SDA  (via drill 0.35)
  Top 0.203: IC5.5 32,29.75 33,28.75 v46.5,28.75 | IC13.2 77.72,34.48 77.15,33.9 R31.1 76.9,33.9 v76,33
  Route15 0.203: v46.5,28.75 46.25,29 46.25,32.5 48.5,34.75 56.25,34.75 59,32 68,32 68.5,31.5 74.5,31.5 v76,33
I2S_DATA  (via drill 0.35)
  Top 0.203: IC9.1 53.9,29.6 v54,29.5
  Bottom 0.203: v54,29.5 63.75,29.5 64.25,30 66.25,30 66.75,29.5 R6.6
I2S_DATA_BUF
  Top 0.203: IC5.7 48,30.75 48.5,30.25 48.75,30.25 R20.2
I2S_LRCLK  (via drill 0.35)
  Top 0.203: IC10.1 53.9,26.85 v54,26.75 | v64.75,29.25 v69.5,29.25 | v81,37 81,35.92 IC13.7
  Route15 0.203: v69.5,29.25 69.5,29.5 70,30 75.5,30 78,32.5 78,36 79,37 v81,37
  Bottom 0.203: v54,26.75 54.75,27.5 54.75,28.5 55.25,29 64.5,29 v64.75,29.25 66,29.25 66.25,29 R6.5
I2S_LRCLK_BUF
  Top 0.203: IC5.6 29.65,30.25 47.5,30.25 R21.2
I2S_MCLK
  Top 0.203: IC8.2 54.25,33 55,32.25 55,30.5 | 55,30.5 55,30.25 | 55,30.25 55,30 | 55,30 55,27.75 | 55,27.75 55,27.5 | R10.2 55,27.5 | IC9.2 54.75,30.25 | 55,30.25 54.75,30.25 | IC10.2 54.75,27.5 | 54.75,27.5 55,27.5 | 55,30.5 54.75,30.25 | 54.75,30.25 55,30 | 55,27.75 54.75,27.5
I2S_MCLK2
  Top 0.203: IC6.3 56.17,24.07 R11.2
I2S_MCLK_BUF  (via drill 0.35)
  Top 0.203: R18.2 59.25,23.25 v59.25,24.25 59,24.5 R17.2
  Bottom 0.203: v59.25,24.25 59.25,28 59.75,28.5 64.5,28.5 65,28.5 65.53,27.98 IC1.11
I2S_SCK  (via drill 0.35)
  Top 0.203: IC8.1 53.9,32.35 v54,32.25
  Bottom 0.203: v54,32.25 54,32 56,30 63.5,30 64,30.5 66.5,30.5 67.25,29.75 R6.7
I2S_SCK_BUF
  Top 0.203: R19.2 48.25,31.5 31.75,31.5 31.5,31.25 IC5.8
LED0
  Top 0.203: IC13.8 81.62,34.88 82.75,33.75 82.75,30.52 D4.A
LED1
  Top 0.203: IC3.42 69.25,16.5 69,16.75 69,18.5 69.9,19.4 R1.2
MCLK_OSC
  Top 0.203: X3.3 53.3,21 54.25,21 54.75,21.5 R11.1 | X2.3 53.5,24.5 R11.1 | R11.1 55,24.75 55,25.25 55.25,25.5 55.25,25.75 R10.1
MCLR  (via drill 0.35)
  Top 0.203: IC3.9 70.25,4.5 v70.5,4.25 | v74.5,4.25 77.1,4.25 CON2.1
  Bottom 0.203: v74.5,4.25 v70.5,4.25 69.75,3.5 69,3.5 68.25,4.25 66.25,4.25 65.2,5.3 Q1.2 | CON2.1 79,2.35 79,3.65 R5.1
N$1  (via drill 0.35)
  Top 0.203: CON1.B5:CC2 v82.5,19.75
  Bottom 0.203: v82.5,19.75 83.35,19.75 R2.2
N$2  (via drill 0.35)
  Top 0.203: CON1.A5:CC1 v82.5,16.75
  Bottom 0.203: v82.5,16.75 83.35,16.75 R3.2
N$3
  Top 0.508: R4.1 86.25,9.65 86.25,11.4 FB1.2
N$4
  Top 0.508: R4.2 86.4,7.5 C1.1 82.1,7.5 | 82.1,7.5 C2.1 | IC2.3 82.05,7.45 | 82.05,7.45 82.25,7.45 82.25,6.25 81.55,5.55 IC2.1 | 82.05,7.45 82.1,7.5
N$5
  Top 0.203: IC3.31 76.25,13.75 76.5,13.5 76.5,13 76.75,12.75 78,12.75 79.1,11.65 X1.3 79,11.5 C14.1
N$6
  Top 1.016: C57.4 C57.2
  Bottom 0.813: R15.2 8,15.75 8,17.04 C57.2
N$7
  Top 0.203: IC3.32 77.05,14.25 X1.1 77.25,14.05 C15.1
N$8
  Bottom 0.203: IC1.14 67.47,26.4 67.25,26.62 R6.2
N$9
  Top 0.203: R1.1 D1.A
N$10
  Top 0.203: R19.1 49.4,33.65 IC8.4
N$11
  Top 0.203: R20.1 49.1,30.9 IC9.4
N$12
  Top 0.254: IC5.31 23.75,26 22.27,26 C21.2
N$13
  Top 0.254: IC5.40 28.25,26 29.73,26 C17.2
N$14
  Top 0.203: IC10.4 49.4,28.15 R21.1
N$15
  Top 1.016: C58.3 C58.1
  Bottom 0.813: C58.1 8,4.96 8,6.25 R16.1
N$16  (via drill 0.35)
  Top 0.305: Q5.1 42.45,49.3 v43,48.75
  Bottom 0.305: R8.1 44,48.35 Q4.2 44,48.75 v43,48.75
N$17
  Top 0.254: IC5.11 28.25,34 29.73,34 C18.1
N$18
  Top 0.254: IC5.20 23.75,34 22.27,34 C22.1
N$19
  Top 1.016: C71.3 C71.1
  Bottom 0.813: C71.1 8,55.04 8,53.75 R24.1
N$20  (via drill 0.35)
  Top 0.305: IC7.1 45.25,52 46.25,52 v49.25,52
  Bottom 0.305: R9.1 48.25,50.65 48.25,52.1 C42.2 48.65,52 v49.25,52
N$21
  Top 1.016: C70.2 C70.4
  Bottom 0.813: R23.2 8,44.25 8,42.96 C70.2
N$22
  Bottom 0.203: IC1.13 66.83,26.02 66.75,26.1 R6.3
N$23
  Top 0.508: IC4.4 55.2,16.75 C19.1
N$24
  Bottom 0.203: IC1.12 66.17,26.02 66.25,26.1 R6.4
N$25  (via drill 0.35)
  Top 0.305: IC7.2 45,54.25 v46,54.25
  Bottom 0.305: Q4.1 44.7,50.45 44.75,50.5 44.75,51.25 44.75,51.75 45.25,52.25 C42.1 46.75,52.4 46.75,54.05 46.95,54.25 | Q3.3 46.95,54.25 | 46.95,54.25 v46,54.25
N$26
  Top 0.254: IC12.7 11.5,29.25 11,28.75 C73.1
N$27
  Top 0.254: IC12.9 12.5,29.25 13,28.75 C72.1
N$28
  Bottom 0.305: R7.1 43.25,52.4 43.25,54.1 Q2.1 43.45,54.45 44.5,55.5 47,55.5 47.95,56.45 Q3.2
N$29
  Top 0.813: C63.1 7.25,36.5 6.02,35.27 C62.+
  Bottom 0.813: R22.2 7.48,36.75 C62.+
  pour Top (no thermals): 11.5,33.75 12.5,33.75 12.5,35.5 11.5,36.5 11.25,36.5 11.25,35.75 11.5,35.5
N$30
  Bottom 0.305: R12.1 46.1,47 48.05,47 C48.2 | R12.1 46.25,47.15 | R12.1 46.25,47.15 | 46.25,47.15 46.25,48.35 R13.2 46.65,48.75 48.35,48.75 R9.2
N$31  (via drill 0.35)
  Top 0.203: v58.25,54 CON4.A5:CC1 58.25,50.6 IC14.4
  Bottom 0.203: R32.1 58.25,54.6 v58.25,54
N$32  (via drill 0.35)
  Top 0.203: v55.25,54 CON4.B5:CC2 55.25,51.88 55.62,51.5 56.75,51.5 57.25,51 IC14.5
  Bottom 0.203: R33.1 55.25,54.6 v55.25,54
N$33
  Top 0.203: R34.2 54.6,48 56.25,48 IC14.1
  Top 0.305: R37.1 61.75,48.25 60.1,49.9 | IC14.1 56.3,49.05 56.75,49.5 59.5,49.5 59.9,49.9
  Top 0.508: 60.1,49.9 C79.1 59.9,49.9
N$34
  Top 0.203: R34.1 54.6,50 56,50 56.3,50.3 IC14.6
N$35
  Bottom 0.508: IC16.4 78.75,38.75 78.75,39.65 C82.1
N$36
  Top 0.203: D3.K 76.73,28 R25.2
N$37
  Top 0.203: R18.1 58,21 56.25,21 56,20.75 56,20.5 | IC6.5 55.52,20.02 55.75,20.25 | 55.75,20.25 56,20.25 | 56,20.25 56.17,20.07 IC6.6 | 56,20.25 56,20.5 | 56,20.5 55.75,20.25
N$38  (via drill 0.35)
  Top 0.305: D2.1 47.75,53.85 47.75,54.5 45.75,56.5 v45,56.5
  Bottom 0.305: Q2.3 42.7,56.5 44.25,56.5 v45,56.5 45.85,56.5 Q3.1
N$39
  Top 0.203: IC6.2 56.83,24.07 R17.1
N$40
  Bottom 0.508: R39.1 29.4,16.5 C86.1
N$41
  Top 0.203: D4.K 80.73,28.5 75.65,28.5 R26.2
N$42
  Bottom 0.813: FB4.2 R22.1
N$43  (via drill 0.5)
  Top 0.508: C16.1 53.5,12.75 53.3,12.95 IC4.1 | IC4.3 55.2,12.95 54.75,12.5 53.75,12.5 C16.1 | C16.1 v53.5,11
  Bottom 0.508: FB2.2 53.5,12.15 v53.5,11
N$44
  Bottom 0.508: R40.1 21.85,43.5 C87.1
N$45
  Bottom 0.508: R38.1 24.1,16.5 C85.1
N$46
  Bottom 0.508: C88.1 27.15,43.5 R41.1
PGEC
  Top 0.203: IC3.15 73.25,4 72.5,3.25 70.44,3.25 CON2.5
PGED
  Top 0.203: IC3.16 73.75,3.75 72,2 CON2.4
PIC_DATA  (via drill 0.35)
  Top 0.203: IC3.50 64.12,13.75 63.94,13.94 63.94,14.69 64.12,14.88 64.12,16.12 v64.25,16.25
  Bottom 0.203: IC1.4 66.83,17.82 66,17 64.5,17 64.25,16.75 v64.25,16.25
PIC_DDC_EN
  Bottom 0.203: Q1.1 63,5.75 63,17.75 63.5,18.25 64.5,18.25 64.88,18.62 IC1.7
PIC_EN441K  (via drill 0.35)
  Top 0.203: v68.25,17.75 IC3.44
  Bottom 0.203: IC1.2 68.12,18.62 68.25,18.5 v68.25,17.75
PIC_LRCLK  (via drill 0.35)
  Top 0.203: IC3.52 64,12.75 63.5,13.25 63.5,17 v64,17.5
  Bottom 0.203: IC1.5 66.17,17.93 66.09,17.84 65.75,17.5 v64,17.5
PIC_MCLK  (via drill 0.35)
  Top 0.203: v65.5,18.25 63.5,18.25 63,17.75 63,10.75 63.5,10.25 IC3.57
  Bottom 0.203: IC1.6 65.53,18.27 v65.5,18.25
PIC_SCK  (via drill 0.35)
  Top 0.203: IC3.48 66.25,15.5 | 66.25,15.5 66.25,15 65.75,15 65.5,14.75 65.5,14.25 IC3.49 | 66.25,15.5 66.25,17.75 66.75,18.25 v67.5,18.25
  Bottom 0.203: IC1.3 67.47,18.27 v67.5,18.25
SPK_OUTN_L  (via drill 0.35)
  Top 1.016: C52.2 C52.4
  other vias: 20,6.75 21,6.75 21,7.75 20,7.75 10.5,9.75 9.5,9.75
  pour Top (isolate 0.254, no thermals): 16,5.5 16,9 20.5,9 21.25,8.25 21.25,6.25 20.5,5.5
  pour Bottom (isolate 0.254, no thermals): 21.25,8.25 12.75,8.25 10.5,10.5 1,10.5 0.5,10 0.5,8 1,7.5 11,7.5 12.5,6 21.25,6
  pour Top (isolate 0.254, no thermals): 1,7.5 0.5,8 0.5,10 1,10.5 4.75,10.5 5.25,10 5.25,8 4.75,7.5
SPK_OUTN_R  (via drill 0.35)
  Top 1.016: C65.2 C65.4
  other vias: 22.5,52.25 22.5,53.25 21.5,53.25 21.5,52.25 9.5,50.25 10.5,50.25
  pour Bottom (isolate 0.254, no thermals): 23,51.75 12.75,51.75 10.5,49.5 1,49.5 0.5,50 0.5,52 1,52.5 11,52.5 12.5,54 23,54
  pour Top (isolate 0.254, no thermals): 16,51 16,54.5 23.75,54.5 23.75,51
  pour Top (isolate 0.254, no thermals): 1,49.5 0.5,50 0.5,52 1,52.5 4.75,52.5 5.25,52 5.25,50 4.75,49.5
SPK_OUTP_L  (via drill 0.35)
  Top 1.016: C52.1 C52.3
  other vias: 26.25,6.75 25.25,7.75 26.25,7.75 25.25,6.75 10.5,12.25 9.5,12.25
  pour Top (isolate 0.254, no thermals): 34,9 34,5.5 25.75,5.5 25,6.25 25,8.25 25.75,9
  pour Bottom (isolate 0.254, no thermals): 25,6.5 26.75,6.5 26.75,9.75 24,12.5 12.5,12.5 10.5,14.5 1,14.5 0.5,14 0.5,12 1,11.5 11,11.5 12,10.5 23,10.5 25,8.5
  pour Top (isolate 0.254, no thermals): 1,11.5 0.5,12 0.5,14 1,14.5 4.75,14.5 5.25,14 5.25,12 4.75,11.5
SPK_OUTP_R  (via drill 0.35)
  Top 1.016: C65.3 C65.1
  other vias: 27.5,53.25 28.5,53.25 28.5,52.25 27.5,52.25 10.5,47.75 9.5,47.75
  pour Bottom (isolate 0.254, no thermals): 27,53.5 28.75,53.5 28.75,50.25 26,47.5 12.5,47.5 10.5,45.5 1,45.5 0.5,46 0.5,48 1,48.5 11,48.5 12,49.5 25,49.5 27,51.5
  pour Top (isolate 0.254, no thermals): 34,54.5 34,51 27.75,51 27,51.75 27,53.75 27.75,54.5
  pour Top (isolate 0.254, no thermals): 4.75,48.5 5.25,48 5.25,46 4.75,45.5 1,45.5 0.5,46 0.5,48 1,48.5
STM_DDC_EN  (via drill 0.35)
  Top 0.203: v69,27 68.75,27.25 v64.75,27.25 | IC13.16 79.67,42.83 v79.5,43
  Route15 0.203: v69,27 68.75,27.25 68.75,29.75 69.5,30.5 75.25,30.5 77.5,32.75 77.5,38.25 79,39.75 79,42.5 v79.5,43
  Bottom 0.203: IC1.10 64.88,27.12 v64.75,27.25
STM_TX
  Top 0.203: CON5.5 85.33,29.92 83.25,32 83.25,34 82.28,34.98 IC13.9
SWCLK  (via drill 0.35)
  Top 0.203: IC13.19 77.72,40.52 79.25,39 82.5,39 82.75,38.75 v83,38.75
  Bottom 0.203: v83,38.75 84,39.75 85.67,39.75 CON5.1
SWDIO
  Top 0.203: CON5.4 86,32.5 84.25,34.25 84.25,38.75 83.5,39.5 79.5,39.5 78.38,40.62 IC13.18
UART_TX
  Top 0.203: IC3.1 66.25,2.4 CON2.6
USB_D+
  Top 0.27: IC3.37 71.75,17.25 arc-90 73.25,18.75 CON1.B6:DP2 81.88,18.75 arc-90 82.25,18.38 82.25,18.12 arc-90 81.88,17.75 CON1.A6:DP1
USB_D-
  Top 0.27: IC3.36 72.25,17.25 arc-90 73.25,18.25 80.12,18.25 | 80.12,18.25 CON1.A7:DN1 | CON1.B7:DN2 80.62,17.25 arc-90 80.12,17.75 80.12,18.25
USB_VBUS  (via drill 0.35, 0.5)
  Top 0.203: IC3.33 73.75,16 74.25,16 74.5,16.25 79.38,16.25 v80,15.62
  Top 0.508: CON1.B4,A9:VBUS 80.03,20.4 v80,20.38 | CON1.A4,B9:VBUS 80.03,15.6 v80,15.62
  Top 0.813: v83.25,11.5 FB1.1
  Bottom 0.813: v80,20.38 v80,15.62 80,13 81.5,11.5 v83.25,11.5
V+  (via drill 0.35)
  Bottom 0.203: R35.2 72.85,41.5 C76.+
  Bottom 0.508: v42.75,47.25 v41.75,47.25 41.75,48 41.75,49.45 Q4.3 41.75,49.55 41.75,52.1 R7.2 41.5,52.35 41.5,54.25 Q2.2
  pour Bottom (isolate 0.203, no thermals): 57,43.75 56,43.75 55,42.75 55,40.5 53,40.5 53,45 57,45
  pour Bottom (isolate 0.203, no thermals): 66.5,44.75 66.5,43.5 67.75,43.5 69,42.25 69,38 71,38 71,44.75
  pour Top (no thermals): 70,44 71,43 71,40 70,39 50,39 46,43 44.5,43 44,43.5 44,45.75 43.5,46.25 41.25,46.25 41.25,47.75 44,47.75 44,50 44.5,50.5 51.25,50.5 51.75,50 51.75,46 53.75,44
V+_ADC  (via drill 0.35)
  Top 0.203: IC13.12 82.28,42.98 81.5,43.75 78,43.75 77,42.75 v76,42.75
  Bottom 0.203: v76,42.75 75.9,42.75 R35.1 74.75,41.6 74.75,41 74.25,40.5 73.75,40.5 73.1,39.85 R36.1
VIN+
  Bottom 1.27: CON3.1 71,48.95 70.25,48.2 70.25,46.95 FB5.1
VINC_+  (via drill 0.5)
  Top 0.508: CON4.B4,A9:VBUS 54.6,51.52 v54.62,51.5 | CON4.A4,B9:VBUS 59.4,51.52 | 59.4,51.52 v59.38,51.5 | R37.2 61.75,50.25 61,51 59.92,51 59.4,51.52
  Bottom 1.27: FB6.1 54,50.88 v54.62,51.5 v59.38,51.5
VOL_ADC  (via drill 0.35)
  Top 0.203: IC13.11 82.92,42.17 83.25,42.5 v83.5,42.5
  Route15 0.203: R27.5 R27.2
  Bottom 0.203: R27.2 83.75,48.75 85.15,48.75 R28.1 R29.2 85.15,47.15 84.25,46.25 84.25,44.25 83.6,43.6 | 83.6,43.6 C77.1 | 83.6,43.6 83.6,42.6 v83.5,42.5
XVCC  (via drill 0.5)
  Top 0.508: X2.4 50.7,25 48.85,25 C31.1 | X3.4 50.7,21 48.85,21 C32.1 | C32.1 48.65,21 | C31.1 48.4,24.9 | C31.1 48.4,24.9 | 48.4,24.9 47.5,24 47.5,21 | C32.1 48.65,21 | 48.65,21 47.5,21 | 47.5,21 47.5,17.75 48.5,16.75 C24.1 C20.1 53.3,16.75 IC4.5 53.3,15.8 v53.25,15.75
  Bottom 0.508: v53.25,15.75 53.35,15.85 FB3.1

## Text on the board
tPlace: PWR IN | USB Audio Amp | ver4.3